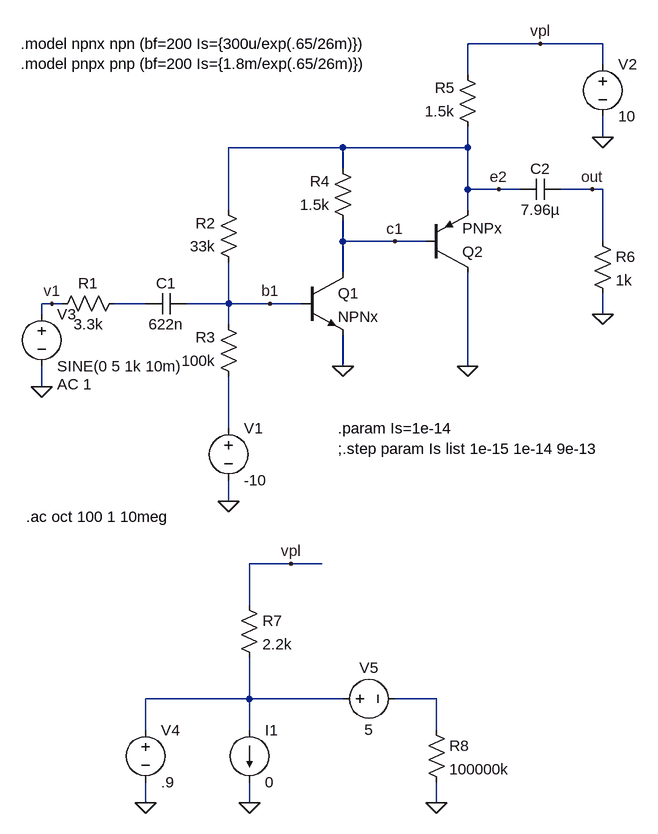
[diagram p0: schematic ss2009.asc]
ss2009.asc, the LTspice schematic file:
Version 4
SHEET 1 1020 2276
WIRE 480 -128 368 -128
WIRE 576 -128 480 -128
WIRE 576 -96 576 -128
WIRE 368 -80 368 -128
WIRE 576 16 576 -16
WIRE 176 32 0 32
WIRE 368 32 368 0
WIRE 368 32 176 32
WIRE 176 64 176 32
WIRE 368 96 368 32
WIRE 416 96 368 96
WIRE 448 96 416 96
WIRE 560 96 512 96
WIRE 576 96 560 96
WIRE 0 128 0 32
WIRE 368 128 368 96
WIRE 176 176 176 144
WIRE 256 176 176 176
WIRE 304 176 256 176
WIRE 576 176 576 96
WIRE 176 224 176 176
WIRE -272 272 -288 272
WIRE -256 272 -272 272
WIRE -128 272 -176 272
WIRE 0 272 0 208
WIRE 0 272 -64 272
WIRE 64 272 0 272
WIRE 112 272 64 272
WIRE -288 288 -288 272
WIRE 576 288 576 256
WIRE 0 304 0 272
WIRE 176 368 176 320
WIRE 368 368 368 224
WIRE -288 400 -288 368
WIRE 0 464 0 384
WIRE 0 576 0 544
WIRE 96 672 32 672
WIRE 144 672 96 672
WIRE 32 736 32 672
WIRE 32 880 32 816
WIRE 32 880 -128 880
WIRE 176 880 32 880
WIRE 320 880 256 880
WIRE -128 928 -128 880
WIRE 32 928 32 880
WIRE 320 928 320 880
WIRE -128 1040 -128 1008
WIRE 32 1040 32 1008
WIRE 320 1040 320 1008
FLAG 0 576 0
FLAG 576 16 0
FLAG 368 368 0
FLAG 176 368 0
FLAG -288 400 0
FLAG 576 288 0
FLAG 560 96 out
FLAG 416 96 e2
FLAG 256 176 c1
FLAG 64 272 b1
FLAG -272 272 v1
FLAG 320 1040 0
FLAG 32 1040 0
FLAG -128 1040 0
FLAG 96 672 vpl
FLAG 480 -128 vpl
SYMBOL voltage 0 448 R0
SYMATTR InstName V1
SYMATTR Value -10
SYMBOL res -160 256 R90
WINDOW 0 0 56 VBottom 2
WINDOW 3 32 56 VTop 2
SYMATTR InstName R1
SYMATTR Value 3.3k
SYMBOL res 16 224 R180
WINDOW 0 36 76 Left 2
WINDOW 3 36 40 Left 2
SYMATTR InstName R2
SYMATTR Value 33k
SYMBOL res 16 400 R180
WINDOW 0 36 76 Left 2
WINDOW 3 36 40 Left 2
SYMATTR InstName R3
SYMATTR Value 100k
SYMBOL res 192 160 R180
WINDOW 0 36 76 Left 2
WINDOW 3 36 40 Left 2
SYMATTR InstName R4
SYMATTR Value 1.5k
SYMBOL res 384 16 R180
WINDOW 0 36 76 Left 2
WINDOW 3 36 40 Left 2
SYMATTR InstName R5
SYMATTR Value 1.5k
SYMBOL npn 112 224 R0
SYMATTR InstName Q1
SYMATTR Value NPNx
SYMBOL pnp 304 224 M180
SYMATTR InstName Q2
SYMATTR Value PNPx
SYMBOL voltage 576 -112 R0
SYMATTR InstName V2
SYMATTR Value 10
SYMBOL cap -64 256 R90
WINDOW 0 0 32 VBottom 2
WINDOW 3 32 32 VTop 2
SYMATTR InstName C1
SYMATTR Value 622n
SYMBOL cap 512 80 R90
WINDOW 0 0 32 VBottom 2
WINDOW 3 32 32 VTop 2
SYMATTR InstName C2
SYMATTR Value 7.96µ
SYMBOL res 560 160 R0
SYMATTR InstName R6
SYMATTR Value 1k
SYMBOL voltage -288 272 R0
WINDOW 123 24 124 Left 2
WINDOW 39 0 0 Left 2
SYMATTR Value2 AC 1
SYMATTR InstName V3
SYMATTR Value SINE(0 5 1k 10m)
SYMBOL voltage -128 912 R0
SYMATTR InstName V4
SYMATTR Value .9
SYMBOL current 32 928 R0
WINDOW 123 0 0 Left 2
WINDOW 39 0 0 Left 2
SYMATTR InstName I1
SYMATTR Value 0
SYMBOL res 16 720 R0
SYMATTR InstName R7
SYMATTR Value 2.2k
SYMBOL voltage 160 880 R270
WINDOW 0 32 56 VTop 2
WINDOW 3 -32 56 VBottom 2
WINDOW 123 0 0 Left 2
WINDOW 39 0 0 Left 2
SYMATTR InstName V5
SYMATTR Value 5
SYMBOL res 304 912 R0
SYMATTR InstName R8
SYMATTR Value 100000k
TEXT -320 -128 Left 2 !.model npnx npn (bf=200 Is={300u/exp(.65/26m)})\n.model pnpx pnp (bf=200 Is={1.8m/exp(.65/26m)})
TEXT -312 600 Left 2 !.ac oct 100 1 10meg
TEXT 168 464 Left 2 !.param Is=1e-14\n;.step param Is list 1e-15 1e-14 9e-13

The netlist it stands for:
* ss2009.asc
V1 N002 0 -10
R1 N001 v1 3.3k
R2 b1 e2 33k
R3 N002 b1 100k
R4 c1 e2 1.5k
R5 e2 vpl 1.5k
Q1 c1 b1 0 0 NPNx
Q2 0 c1 e2 0 PNPx
V2 vpl 0 10
C1 b1 N001 622n
C2 out e2 7.96µ
R6 out 0 1k
V3 v1 0 SINE(0 5 1k 10m) AC 1
V4 N003 0 .9
I1 N003 0 0
R7 vpl N003 2.2k
V5 N003 N004 5
R8 N004 0 100000k
.model NPN NPN
.model PNP PNP
.lib standard.bjt
.model npnx npn (bf=200 Is={300u/exp(.65/26m)})
.model pnpx pnp (bf=200 Is={1.8m/exp(.65/26m)})
.ac oct 100 1 10meg
.param Is=1e-14
;.step param Is list 1e-15 1e-14 9e-13
.backanno
.end